# EAGLE design BpodMainBoard_r0_5 (EAGLE 6.3)
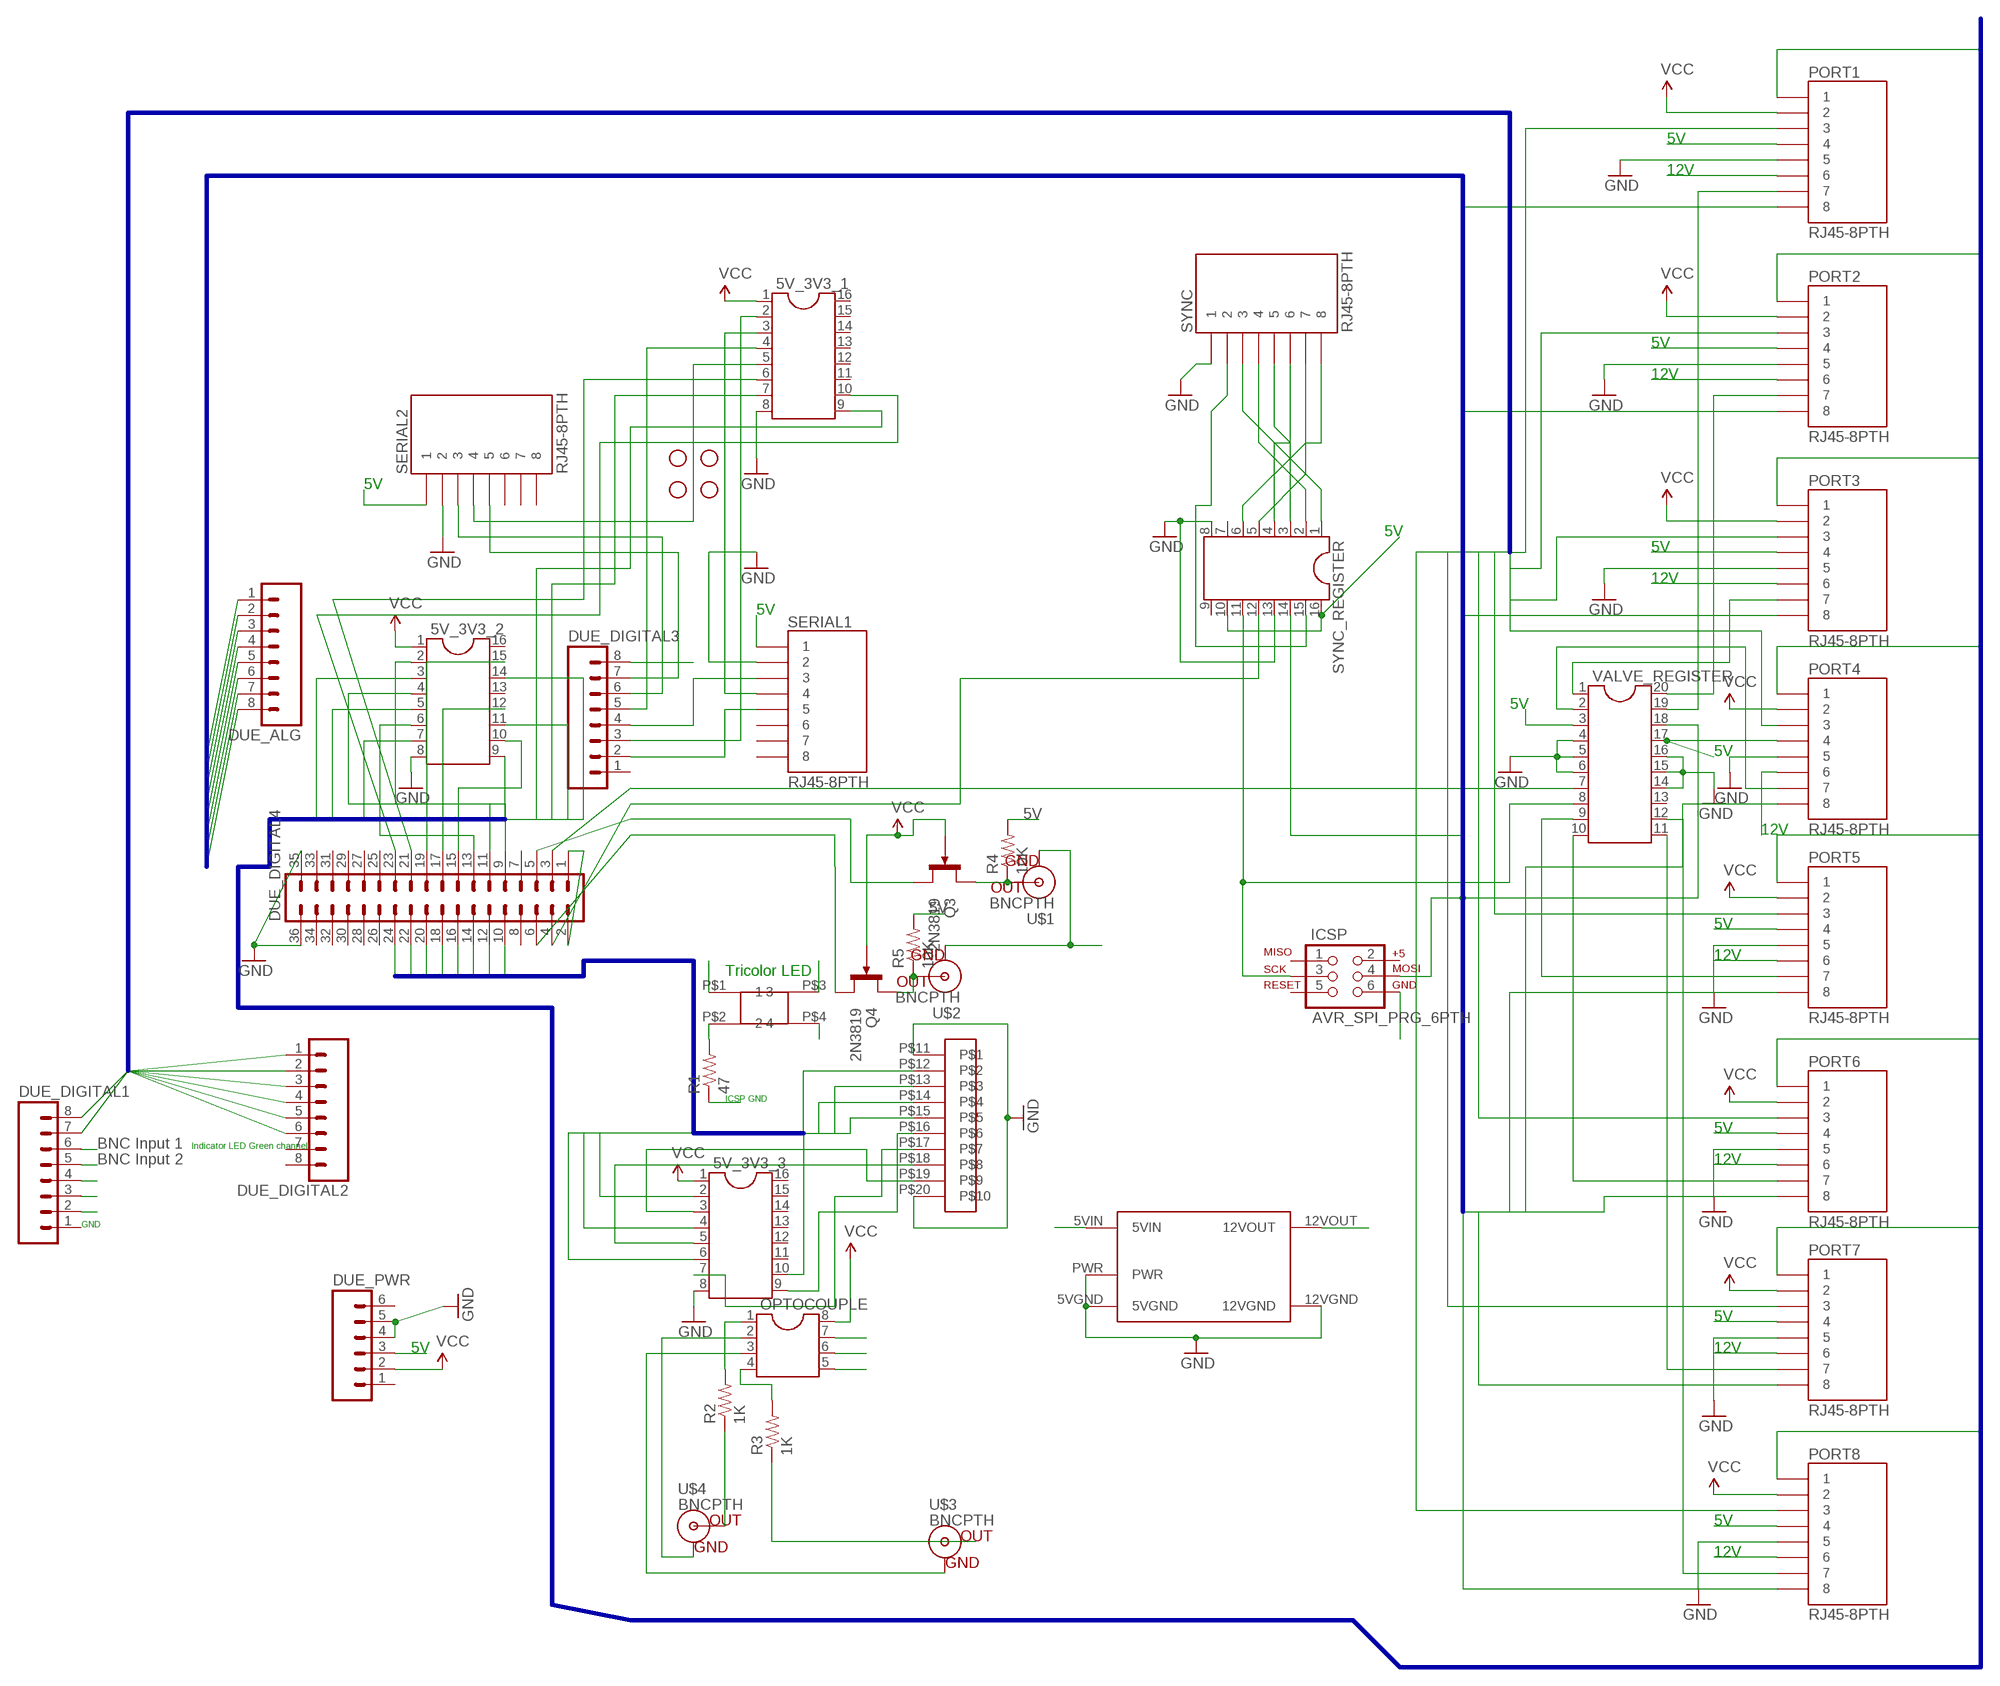
[diagram p0: schematic, sheet 1]

## Parts
5V_3V3_1  DIL16  [DIL16]
5V_3V3_2  DIL16  [DIL16]
5V_3V3_3  DIL16  [DIL16]
DUE_ALG  M081X08  [1X08]
DUE_DIGITAL1  M081X08  [1X08]
DUE_DIGITAL2  M081X08  [1X08]
DUE_DIGITAL3  M081X08  [1X08]
DUE_DIGITAL4  MA18-2  [MA18-2]
DUE_PWR  M06SIP  [1X06]
ICSP  AVR_SPI_PRG_6PTH  [2X3]
JP1  STAND-OFF  [STAND-OFF]
JP2  STAND-OFF  [STAND-OFF]
JP3  STAND-OFF  [STAND-OFF]
JP4  STAND-OFF  [STAND-OFF]
OPTOCOUPLE  DIL8  [DIL08]
PORT1  RJ45-8PTH  [RJ45-8]
PORT2  RJ45-8PTH  [RJ45-8]
PORT3  RJ45-8PTH  [RJ45-8]
PORT4  RJ45-8PTH  [RJ45-8]
PORT5  RJ45-8PTH  [RJ45-8]
PORT6  RJ45-8PTH  [RJ45-8]
PORT7  RJ45-8PTH  [RJ45-8]
PORT8  RJ45-8PTH  [RJ45-8]
Q3  2N3819  [TO92F]
Q4  2N3819  [TO92F]
R1  47  RESISTORAXIAL-0.3  [AXIAL-0.3]
R2  1K  RESISTORAXIAL-0.3  [AXIAL-0.3]
R3  1K  RESISTORAXIAL-0.3  [AXIAL-0.3]
R4  10K  RESISTORAXIAL-0.3  [AXIAL-0.3]
R5  10K  RESISTORAXIAL-0.3  [AXIAL-0.3]
SERIAL1  RJ45-8PTH  [RJ45-8]
SERIAL2  RJ45-8PTH  [RJ45-8]
SYNC  RJ45-8PTH  [RJ45-8]
SYNC_REGISTER  DIL16  [DIL16]
U$1  BNCPTH  [BNC]
U$2  BNCPTH  [BNC]
U$3  BNCPTH  [BNC]
U$4  BNCPTH  [BNC]
U$5  TDK_LAMBDA_5V_TO_12V  [TDK_LAMBDA_5V_12V]
U$6  10POS_SPRING_TERMINAL  [10POS_SCREW_TERMINAL]
U$8  SQUARE_TRICOLOR_LED  [SQUARE_TRICOLOR_LED]
VALVE_REGISTER  DIL20  [DIL20]

## Nets
5V: DUE_DIGITAL4.1 DUE_DIGITAL4.2 DUE_PWR.3 PORT1.4 PORT2.4 PORT3.4 PORT4.4 PORT5.4 PORT6.4 PORT7.4 PORT8.4 R4.P$2 R5.P$2 SERIAL1.1 SERIAL2.1 SYNC_REGISTER.10 SYNC_REGISTER.16 U$5.5VIN VALVE_REGISTER.3 VALVE_REGISTER.17
12V: PORT1.6 PORT2.6 PORT3.6 PORT4.6 PORT5.6 PORT6.6 PORT7.6 PORT8.6 U$5.12VOUT
ANALOG_BUS1: DUE_ALG.1 PORT1.8
ANALOG_BUS2: DUE_ALG.2 PORT2.8
ANALOG_BUS3: DUE_ALG.3 PORT3.8
ANALOG_BUS4: DUE_ALG.4 PORT4.8
ANALOG_BUS5: DUE_ALG.5 PORT5.8
ANALOG_BUS6: DUE_ALG.6 PORT6.8
ANALOG_BUS7: DUE_ALG.7 PORT7.8
ANALOG_BUS8: DUE_ALG.8 PORT8.8
BNCIN1: DUE_DIGITAL1.6 OPTOCOUPLE.7
BNCIN2: DUE_DIGITAL1.5 OPTOCOUPLE.6
DIGITAL_BUS1: 5V_3V3_2.3 PORT1.1
DIGITAL_BUS2: 5V_3V3_2.5 PORT2.1
DIGITAL_BUS3: 5V_3V3_2.7 PORT3.1
DIGITAL_BUS4: 5V_3V3_2.9 PORT4.1
DIGITAL_BUS5: 5V_3V3_2.11 PORT5.1
DIGITAL_BUS6: 5V_3V3_2.14 PORT6.1
DIGITAL_BUS7: 5V_3V3_1.7 PORT7.1
DIGITAL_BUS8: 5V_3V3_1.9 PORT8.1
DSUB_BUS1: 5V_3V3_3.2 DUE_DIGITAL4.10
DSUB_BUS2: 5V_3V3_3.4 DUE_DIGITAL4.12
DSUB_BUS3: 5V_3V3_3.6 DUE_DIGITAL4.14
DSUB_BUS4: 5V_3V3_3.10 DUE_DIGITAL4.16
DSUB_BUS5: DUE_DIGITAL4.18 U$6.P$15
DSUB_BUS6: DUE_DIGITAL4.20 U$6.P$14
DSUB_BUS7: DUE_DIGITAL4.22 U$6.P$13
DSUB_BUS8: DUE_DIGITAL4.24 U$6.P$12
GND: 5V_3V3_1.8 5V_3V3_2.8 5V_3V3_3.8 DUE_DIGITAL4.35 DUE_DIGITAL4.36 DUE_PWR.4 DUE_PWR.5 PORT1.5 PORT2.5 PORT3.5 PORT4.5 PORT5.5 PORT6.5 PORT7.5 PORT8.5 SERIAL1.2 SERIAL2.2 SYNC.1 SYNC_REGISTER.8 SYNC_REGISTER.13 U$5.5VGND U$5.12VGND U$5.PWR U$6.P$11 U$6.P$20 VALVE_REGISTER.4 VALVE_REGISTER.5 VALVE_REGISTER.6 VALVE_REGISTER.14 VALVE_REGISTER.15 VALVE_REGISTER.16
ICSP_GND: ICSP.6 R1.P$1
LED1: DUE_DIGITAL1.4 U$8.P$3
LED2: DUE_DIGITAL1.3 U$8.P$4
LED3: DUE_DIGITAL3.8 U$8.P$1
LED_BUS1: DUE_DIGITAL1.7 PORT1.3
LED_BUS2: DUE_DIGITAL1.8 PORT2.3
LED_BUS3: DUE_DIGITAL2.1 PORT3.3
LED_BUS4: DUE_DIGITAL2.2 PORT4.3
LED_BUS5: DUE_DIGITAL2.3 PORT5.3
LED_BUS6: DUE_DIGITAL2.4 PORT6.3
LED_BUS7: DUE_DIGITAL2.5 PORT7.3
LED_BUS8: DUE_DIGITAL2.6 PORT8.3
N$1: R2.P$1 U$4.S(OUT)
N$2: R3.P$1 U$3.S(OUT)
N$3: OPTOCOUPLE.1 R2.P$2
N$4: OPTOCOUPLE.4 R3.P$2
N$5: OPTOCOUPLE.2 U$4.GND
N$6: OPTOCOUPLE.3 U$3.GND
N$7: Q3.D R4.P$1 U$1.S(OUT)
N$8: Q4.D R5.P$1 U$2.S(OUT)
N$9: PORT1.7 VALVE_REGISTER.19
N$10: PORT2.7 VALVE_REGISTER.20
N$11: PORT3.7 VALVE_REGISTER.1
N$12: PORT4.7 VALVE_REGISTER.2
N$13: PORT5.7 VALVE_REGISTER.9
N$14: PORT6.7 VALVE_REGISTER.10
N$15: PORT7.7 VALVE_REGISTER.11
N$16: PORT8.7 VALVE_REGISTER.12
N$17: SYNC.2 SYNC_REGISTER.15
N$18: SYNC.3 SYNC_REGISTER.1
N$19: SYNC.4 SYNC_REGISTER.2
N$20: DUE_DIGITAL4.3 VALVE_REGISTER.7
N$21: SYNC.5 SYNC_REGISTER.3
N$22: SYNC.6 SYNC_REGISTER.4
N$23: SYNC.7 SYNC_REGISTER.5
N$24: SYNC.8 SYNC_REGISTER.6
N$25: R1.P$2 U$8.P$2
N$26: DUE_DIGITAL4.5 Q3.S
N$28: DUE_DIGITAL4.4 SYNC_REGISTER.12
N$29: DUE_DIGITAL4.6 Q4.S
N$32: 5V_3V3_1.3 SERIAL1.4
N$33: 5V_3V3_1.2 DUE_DIGITAL3.3
N$34: DUE_DIGITAL3.4 SERIAL1.3
N$35: 5V_3V3_1.5 SERIAL2.4
N$36: 5V_3V3_1.4 DUE_DIGITAL3.5
N$37: DUE_DIGITAL3.2 SERIAL1.5
N$39: 5V_3V3_1.6 DUE_DIGITAL4.21
N$40: DUE_DIGITAL3.6 SERIAL2.3
N$41: 5V_3V3_1.10 DUE_DIGITAL4.23
N$42: DUE_DIGITAL3.7 SERIAL2.5
N$43: 5V_3V3_2.2 DUE_DIGITAL4.9
N$44: 5V_3V3_2.4 DUE_DIGITAL4.11
N$45: 5V_3V3_2.6 DUE_DIGITAL4.13
N$46: 5V_3V3_2.10 DUE_DIGITAL4.15
N$47: 5V_3V3_2.12 DUE_DIGITAL4.17
N$48: 5V_3V3_2.15 DUE_DIGITAL4.19
N$49: 5V_3V3_3.3 U$6.P$19
N$50: 5V_3V3_3.5 U$6.P$18
N$51: 5V_3V3_3.7 U$6.P$17
N$52: 5V_3V3_3.9 U$6.P$16
SPI_CLK: ICSP.3 SYNC_REGISTER.11 VALVE_REGISTER.8
SPI_DATA: ICSP.4 SYNC_REGISTER.14 VALVE_REGISTER.18
UPPER_GND: DUE_DIGITAL1.2 OPTOCOUPLE.5 U$1.GND U$2.GND
VCC: 5V_3V3_1.1 5V_3V3_2.1 5V_3V3_3.1 DUE_PWR.2 OPTOCOUPLE.8 PORT1.2 PORT2.2 PORT3.2 PORT4.2 PORT5.2 PORT6.2 PORT7.2 PORT8.2 Q3.G Q4.G
Unconnected: 5V_3V3_1.11 5V_3V3_1.12 5V_3V3_1.13 5V_3V3_1.14 5V_3V3_1.15 5V_3V3_1.16 5V_3V3_2.13 5V_3V3_2.16 5V_3V3_3.11 5V_3V3_3.12 5V_3V3_3.13 5V_3V3_3.14 5V_3V3_3.15 5V_3V3_3.16 DUE_DIGITAL1.1 DUE_DIGITAL2.7 DUE_DIGITAL2.8 DUE_DIGITAL3.1 DUE_DIGITAL4.7 DUE_DIGITAL4.8 DUE_DIGITAL4.25 DUE_DIGITAL4.26 DUE_DIGITAL4.27 DUE_DIGITAL4.28 DUE_DIGITAL4.29 DUE_DIGITAL4.30 DUE_DIGITAL4.31 DUE_DIGITAL4.32 DUE_DIGITAL4.33 DUE_DIGITAL4.34 DUE_PWR.1 DUE_PWR.6 ICSP.1 ICSP.2 ICSP.5 SERIAL1.6 SERIAL1.7 SERIAL1.8 SERIAL2.6 SERIAL2.7 SERIAL2.8 SYNC_REGISTER.7 SYNC_REGISTER.9 VALVE_REGISTER.13

## Buses
LED_BUS[1..8]
DSUB_BUS[1..8]
ANALOG_BUS[1..8]
DIGITAL_BUS[1..8]

## Notes on the sheet
- 5V
- 12V
- 5V
- 12V
- 5V
- 5V
- 5V
- 12V
- 5V
- 5V
- 5V
- 5V
- 12V
- 5V
- 5V
- 12V
- Tricolor LED
- ICSP GND
- 5V
- BNC Input 1 | Indicator LED Green channel
- BNC Input 2 | 12V
- GND
- 5V
- 5V | 12V
- 5V
- 12V

## Library data of the parts
5V_3V3_1-5V_3V3_3 SYNC_REGISTER = ic-package:DIL16: Dual In Line / Socket
DUE_ALG DUE_DIGITAL1-DUE_DIGITAL3 = SparkFun:M08: Header 8 Standard 8-pin 0.1" header. Use with straight break away headers (SKU : PRT-00116), right angle break away headers (PRT-00553), swiss pins (PRT-00743), machine pins (PRT-00117), and female headers (PRT-00115).
DUE_DIGITAL4 = con-lstb:MA18-2: PIN HEADER
DUE_PWR = SparkFun:M06: Header 6 Standard 6-pin 0.1" header. Use with straight break away headers (SKU : PRT-00116), right angle break away headers (PRT-00553), swiss pins (PRT-00743), machine pins (PRT-00117), and female headers (PRT-00115). Molex polarized connector foot print use with SKU : PRT-08094 with associated crimp pins and housings. NOTES ON THE VARIANTS LOCK and LOCK_LONGPADS... This footprint was designed to help hold the alignment of a through-hole component (i.e. 6-pin header) while soldering it into place. You may notice that each hole has been shifted either up or down by 0.005 of an inch from it's more standard position (which is a perfectly straight line). This slight alteration caused the pins (the squares in the middle) to touch the edges of the holes. Because they are alternating, it causes a "brace" to hold the component in place. 0.005 has proven to be the perfect amount of "off-center" position when using our standard breakaway headers. Although looks a little odd when you look at the bare footprint, once you have a header in there, the alteration is very hard to notice. Also, if you push a header all the way into place, it is covered up entirely on the bottom side. This idea of altering the position of holes to aid alignment will be further integrated into the Sparkfun Library for other footprints. It can help hold any component with 3 or more connection pins.
ICSP = SparkFun:AVR_SPI_PRG_6: AVR ISP 6 Pin This is the reduced ISP connector for AVR programming. Common on Arduino. This footprint will take up less PCB space and can be used with a 10-pin to 6-pin adapter such as SKU: BOB-08508
JP1-JP4 = SparkFun:STAND-OFF: Stand Off This is the mechanical footprint for a #4 phillips button head screw. Use the keepout ring to avoid running the screw head into surrounding components. SKU : PRT-00447
OPTOCOUPLE = ic-package:DIL8: Dual In Line / Socket
PORT1-PORT8 SERIAL1 SERIAL2 SYNC = SparkFun:RJ45-8: RJ45 Jack Simple RJ45, 8-pin connection - connector for common Cat5, Cat5e, and Cat6 Ethernet cables. Footprint not yet proven in production. Connector sku is PRT-00643; Breakout PCB sku is BOB-00716.
Q3 Q4 = transistor-small-signal:2N3819: N-CHANNEL FET
R1 = SparkFun-Passives:RESISTOR: Resistor Basic schematic elements and footprints for 0603, 1206, and PTH resistors.
R2-R5 = SparkFun:RESISTOR: Resistor Basic schematic elements and footprints for 0603, 1206, and PTH resistors.
U$1-U$4 = SparkFun:BNC: BNC Connector, Mouser Part# 5227161
U$5 = JoshParts:TDK_LAMBDA_5V_TO_12V
U$6 = JoshParts:10POS_SPRING_TERMINAL
U$8 = JoshParts:SQUARE_TRICOLOR_LED
VALVE_REGISTER = ic-package:DIL20: Dual In Line / Socket

## Net classes
0 default: width 0.254 mm, clearance 0.254 mm

## Board
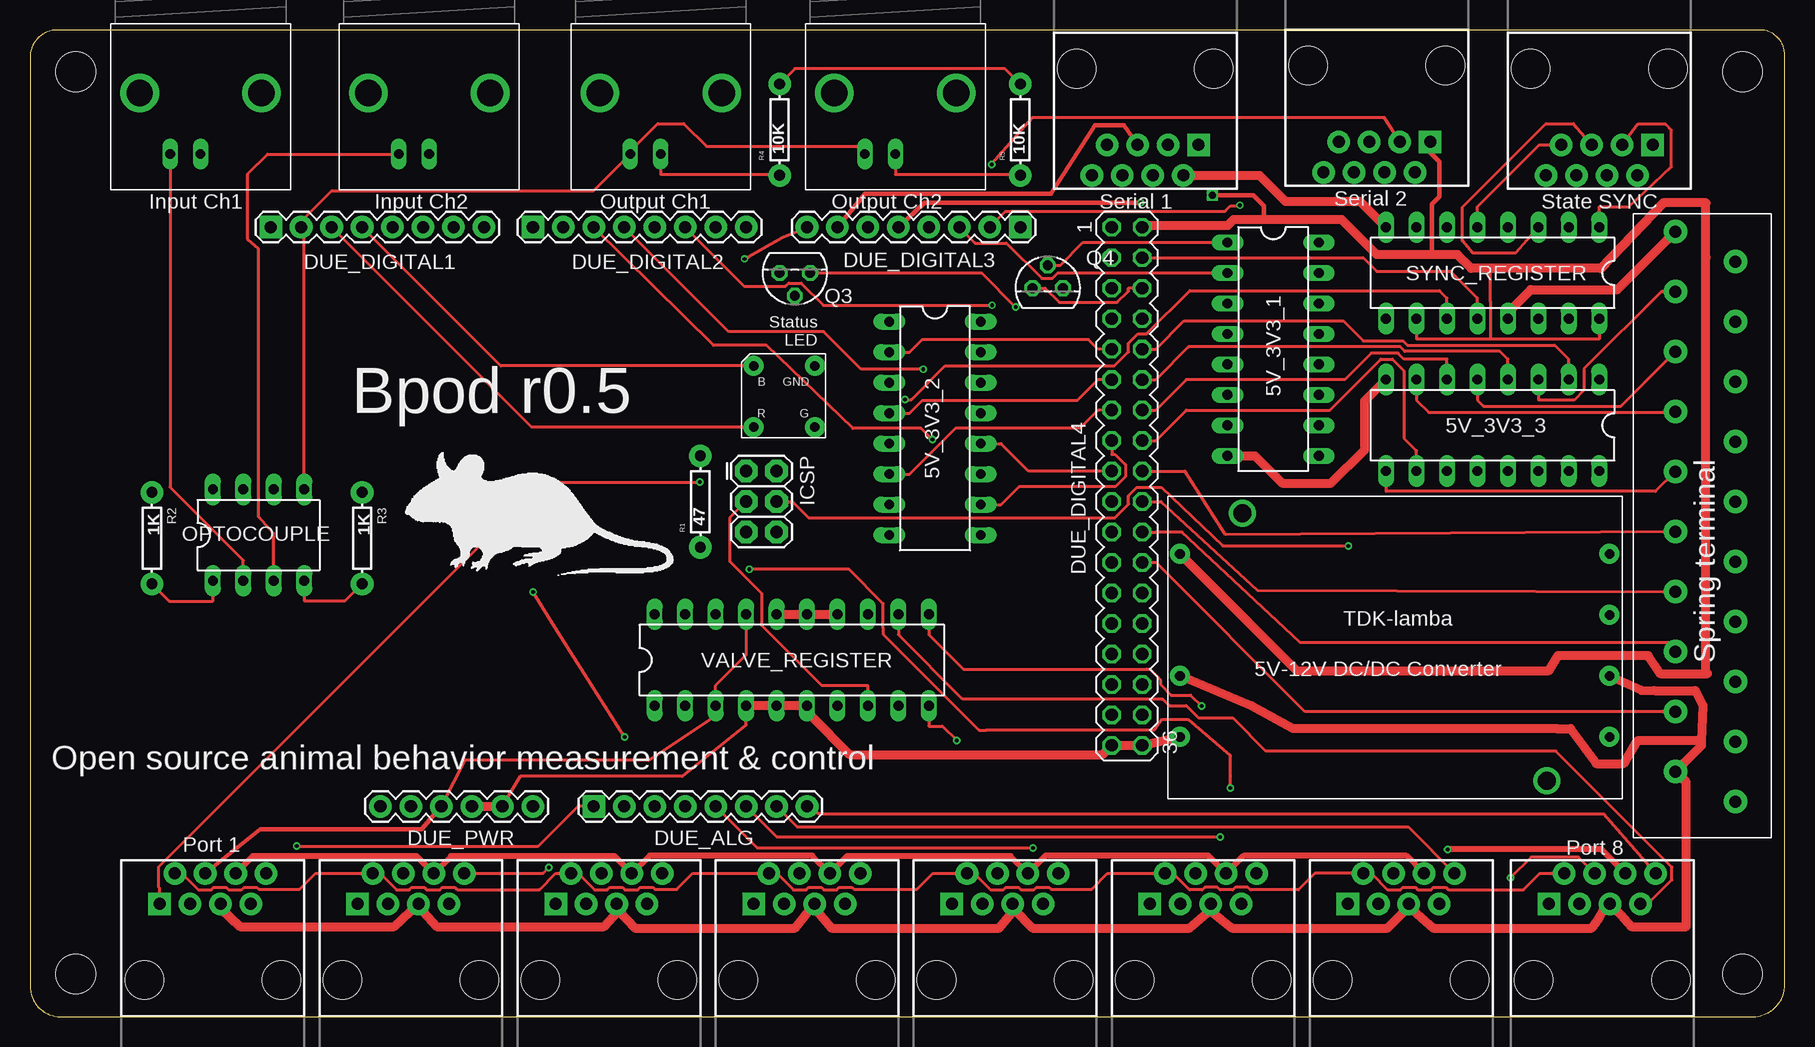
[diagram p1: board, top side]
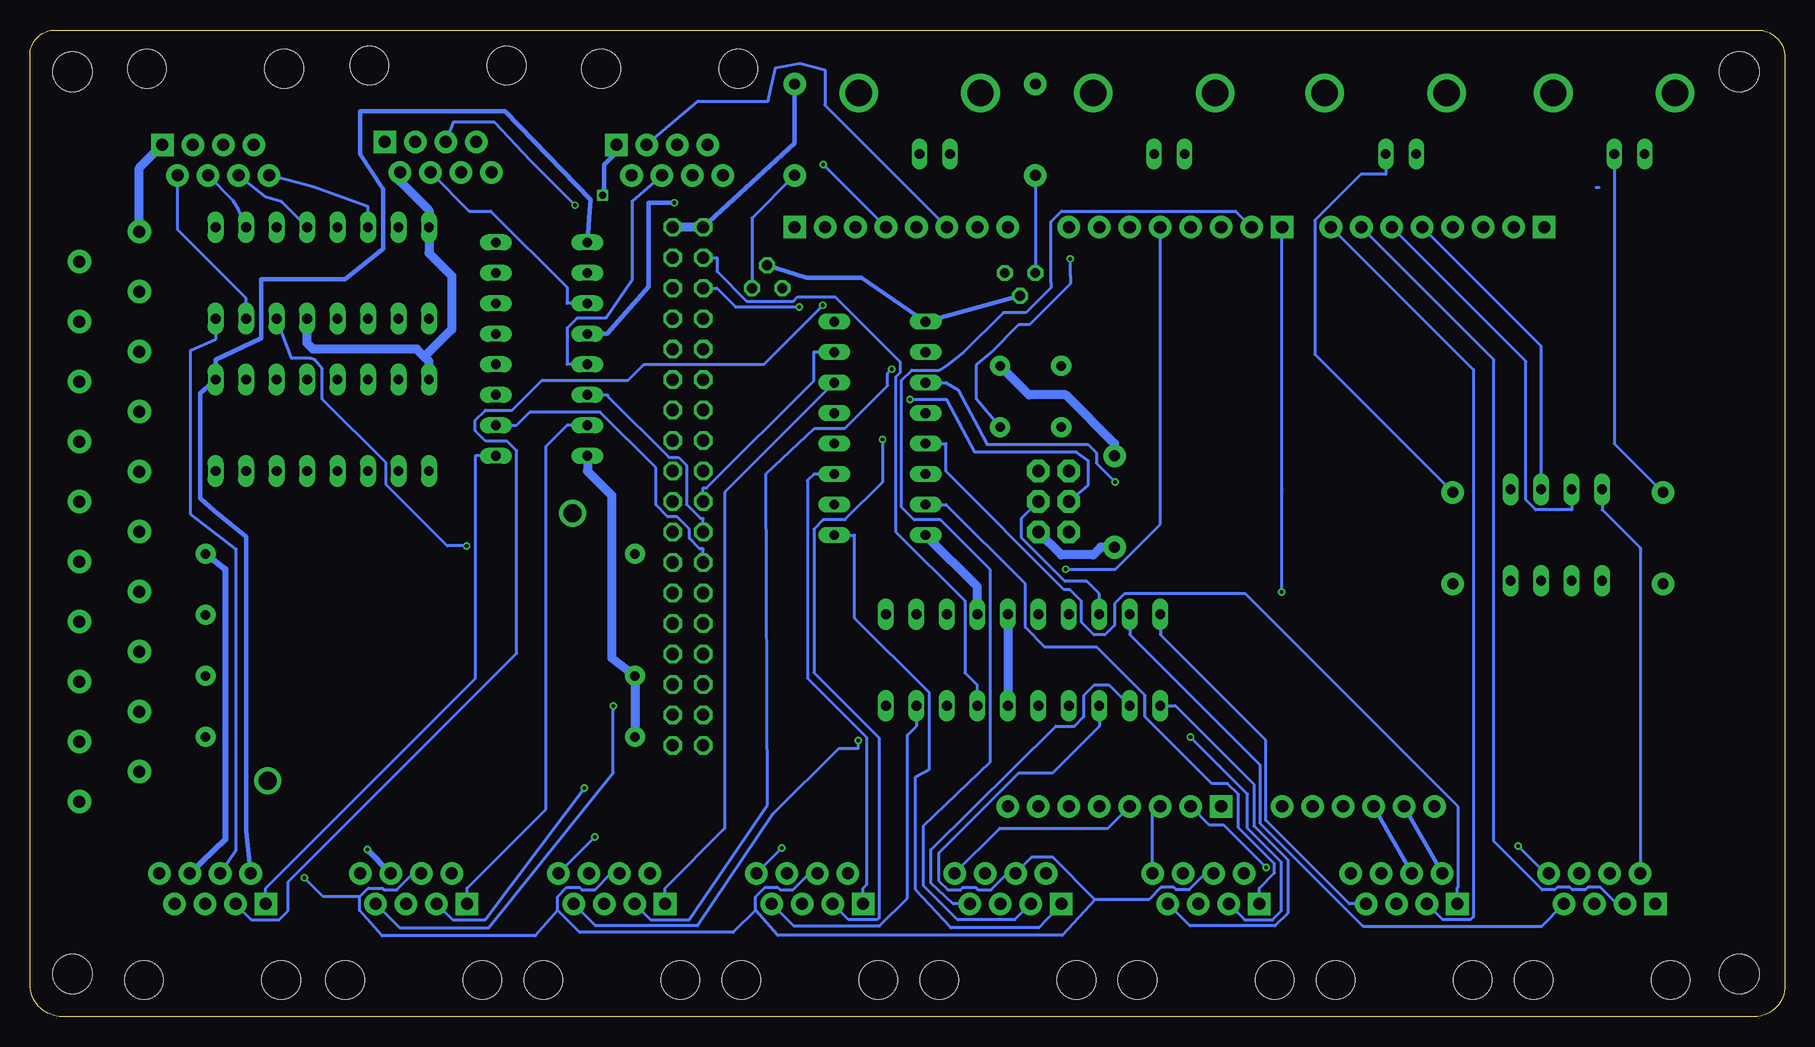
[diagram p2: board, bottom side, seen from below]

Size 146.28 x 82.22 mm. Coordinates in mm from the lower left corner, seen from the top.
Outline: 143.6,0 arc90 146.28,2.69 146.28,80.13 arc90 144.2,82.22 2.28,82.22 arc90 0,79.94 0,2.54 arc90 2.54,0 143.6,0
Copper layers (1*16): Top 0.035mm / dielectric 1.5mm / Bottom 0.035mm
Design rules "SeeedStudio_2layer_DRU_no_angle_20140221": minimum track width 6mil, minimum drill 12mil, track to track 6mil, track to pad 6mil, pad to pad 6mil, via to via 6mil, smd to smd 0mil, copper to edge 10mil, drill to drill 10mil, minimum pad ring 10mil, minimum via ring 6mil, stop-mask expansion 2mil, vias tented up to drill 100mil, thermal gap 10mil

### Footprints (pad centres in the part's own frame; a part is rotated, then mirrored left to right if it is on the bottom)
DIL16 = drill 0.813 long: 1 -8.89,-3.81; 2 -6.35,-3.81; 3 -3.81,-3.81; 4 -1.27,-3.81; 5 1.27,-3.81; 6 3.81,-3.81; 7 6.35,-3.81; 8 8.89,-3.81; 9 8.89,3.81; 10 6.35,3.81; 11 3.81,3.81; 12 1.27,3.81; 13 -1.27,3.81; 14 -3.81,3.81; 15 -6.35,3.81; 16 -8.89,3.81
1X08 = drill 1.016 pad 1.88 square: 1 0,0 | drill 1.016 pad 1.88: 2 2.54,0; 3 5.08,0; 4 7.62,0; 5 10.16,0; 6 12.7,0; 7 15.24,0; 8 17.78,0
MA18-2 = drill 1.016 octagon: 1 -21.59,-1.27; 2 -21.59,1.27; 3 -19.05,-1.27; 4 -19.05,1.27; 5 -16.51,-1.27; 6 -16.51,1.27; 7 -13.97,-1.27; 8 -13.97,1.27; 9 -11.43,-1.27; 10 -11.43,1.27; 11 -8.89,-1.27; 12 -8.89,1.27; 13 -6.35,-1.27; 14 -6.35,1.27; 15 -3.81,-1.27; 16 -3.81,1.27; 17 -1.27,-1.27; 18 -1.27,1.27; 19 1.27,-1.27; 20 1.27,1.27; 21 3.81,-1.27; 22 3.81,1.27; 23 6.35,-1.27; 24 6.35,1.27; 25 8.89,-1.27; 26 8.89,1.27; 27 11.43,-1.27; 28 11.43,1.27; 29 13.97,-1.27; 30 13.97,1.27; 31 16.51,-1.27; 32 16.51,1.27; 33 19.05,-1.27; 34 19.05,1.27; 35 21.59,-1.27; 36 21.59,1.27
1X06 = drill 1.016 pad 1.88: 1 0,0; 2 2.54,0; 3 5.08,0; 4 7.62,0; 5 10.16,0; 6 12.7,0
2X3 = drill 1.016 pad 1.88 octagon: 1 0,0; 2 0,2.54; 3 2.54,0; 4 2.54,2.54; 5 5.08,0; 6 5.08,2.54
STAND-OFF = hole 3.302: 0,0
DIL08 = drill 0.813 long: 1 -3.81,-3.81; 2 -1.27,-3.81; 3 1.27,-3.81; 4 3.81,-3.81; 5 3.81,3.81; 6 1.27,3.81; 7 -1.27,3.81; 8 -3.81,3.81
RJ45-8 = drill 1 pad 1.88 square: 1 -4.445,6.35 | drill 1 pad 1.88: 2 -3.175,8.89; 3 -1.905,6.35; 4 -0.635,8.89; 5 0.635,6.35; 6 1.905,8.89; 7 3.175,6.35; 8 4.445,8.89 | hole 3.2: -5.715,0; 5.715,0
TO92F = drill 0.813 octagon: D 1.27,0; G 0,1.905; S -1.27,0
AXIAL-0.3 = drill 0.9 pad 1.88: P$1 -3.81,0; P$2 3.81,0
BNC = drill 2.2: 3 -5.08,5.08; 4 5.08,5.08 | drill 0.8 long: GND -2.54,0; S 0,0
TDK_LAMBDA_5V_12V = drill 0.8 pad 1.676: 5VGND -6,-12.24; 5VIN -6,3; 12VGND 29.8,-7.16; 12VOUT 29.8,3; P$4 29.8,-12.24; P$6 29.8,-2.08; PWR -6,-7.16 | drill 1.5: P$8 -0.8,6.4; P$9 24.6,-15.92
10POS_SCREW_TERMINAL = drill 1 pad 1.93: P$1 -10,-5; P$2 -5,-5; P$3 0,-5; P$4 5,-5; P$5 10,-5; P$6 -15,-5; P$7 15,-5; P$8 -20,-5; P$9 20,-5; P$10 -25,-5; P$11 -22.5,0; P$12 -17.5,0; P$13 -12.5,0; P$14 -7.5,0; P$15 -2.5,0; P$16 2.5,0; P$17 7.5,0; P$18 12.5,0; P$19 17.5,0; P$20 22.5,0
SQUARE_TRICOLOR_LED = drill 0.8 pad 1.676: P$1 -5.1,5.1; P$2 -5.1,0; P$3 0,0; P$4 0,5.1
DIL20 = drill 0.813 long: 1 -11.43,-3.81; 2 -8.89,-3.81; 3 -6.35,-3.81; 4 -3.81,-3.81; 5 -1.27,-3.81; 6 1.27,-3.81; 7 3.81,-3.81; 8 6.35,-3.81; 9 8.89,-3.81; 10 11.43,-3.81; 11 11.43,3.81; 12 8.89,3.81; 13 6.35,3.81; 14 3.81,3.81; 15 1.27,3.81; 16 -1.27,3.81; 17 -3.81,3.81; 18 -6.35,3.81; 19 -8.89,3.81; 20 -11.43,3.81

### Placement (x,y rotation side)
5V_3V3_1  103.63,55.63 270 top
5V_3V3_2  75.44,49.02 270 top
5V_3V3_3  121.92,49.28 180 top
DUE_ALG  46.99,17.53 0 top
DUE_DIGITAL1  20.07,65.79 0 top
DUE_DIGITAL2  41.91,65.79 0 top
DUE_DIGITAL3  82.55,65.79 180 top
DUE_DIGITAL4  91.44,44.2 270 top
DUE_PWR  29.21,17.53 0 top
ICSP  59.69,45.47 270 top
JP1  3.81,78.74 0 top
JP2  3.81,3.56 0 top
JP3  142.75,3.56 0 top
JP4  142.75,78.74 0 top
OPTOCOUPLE  19.05,40.13 0 top
PORT1  15.24,3.05 0 top
PORT2  31.75,3.05 0 top
PORT3  48.26,3.05 0 top
PORT4  64.77,3.05 0 top
PORT5  81.28,3.05 0 top
PORT6  97.79,3.05 0 top
PORT7  114.3,3.05 0 top
PORT8  131.06,3.05 0 top
Q3  63.75,61.98 180 top
Q4  84.84,60.71 0 top
R1  55.88,42.93 90 top
R2  10.16,39.88 270 top
R3  27.69,39.88 270 top
R4  62.48,73.91 90 top
R5  82.55,73.91 90 top
SERIAL1  112.27,79.25 180 top
SERIAL2  92.96,78.99 180 top
SYNC  130.81,78.99 180 top
SYNC_REGISTER  121.92,61.98 180 top
U$1  52.58,71.88 0 top
U$2  72.14,71.88 0 top
U$3  33.27,71.88 0 top
U$4  14.22,71.88 0 top
U$5  101.85,35.56 0 top
U$6  137.16,42.93 90 top
U$7  [MOUSELOGO]  29.34,48.9 270 top
U$8  60.33,54.23 180 top
VALVE_REGISTER  63.5,29.72 0 top

### Tracks (layer width: path | path; a pad name or v marks a point on that pad's centre or on a via)
5V  (via drill 0.3 pad 0.61, 0.6)
  Top 0.254: DUE_PWR.3 35.33,19.58 36.22,21.36 51.55,21.36 57.15,25.06 VALVE_REGISTER.3 57.15,27.61 59.69,30.15 VALVE_REGISTER.17 | PORT8.4 129.07,13.3 125.14,13.3 v123.41,11.57 | 121.72,56.46 115.57,56.46 SYNC_REGISTER.10 | 121.72,56.46 121.72,59.6 121.72,62.31 121.67,62.36 | 121.72,56.46 130.81,56.46 SYNC_REGISTER.16 | R5.P$2 81.27,79 63.77,79 R4.P$2
  Top 0.381: PORT1.4 19.18,15.62 32.64,15.62 DUE_PWR.3 | SERIAL1.1 116.71,72.01 117.47,71.25 117.47,68.33 116.84,67.69 116.84,63.5 | v98.55,68.45 101.98,68.45 102.87,67.56 102.87,66.42
  Top 0.762: U$5.5VIN 105.58,28.83 126.62,28.83 127.38,30.1 134.87,30.1 135.89,28.57 139.83,28.57 139.7,28.7 139.7,63.25 139.7,67.82 136.14,67.82 130.94,62.36 121.92,62.36 121.67,62.36 120.14,62.36 119,63.5 116.84,63.5 112.27,63.5 109.35,66.42 102.87,66.42 100.33,66.42 99.82,65.91 92.84,65.91 DUE_DIGITAL4.2
  Bottom 0.254: VALVE_REGISTER.3 57.15,24.21 61.06,20.3 63.87,20.3 70.55,13.63 70.55,11.34 69.78,10.57 68.72,10.57 68.52,10.77 67.45,10.77 67.25,10.57 66.18,10.57 64.81,11.94 PORT4.4 62.8,13.27 61.03,13.27 57.5,9.74 | SYNC_REGISTER.16 130.81,56.46 132.87,55.55 132.87,41.85 129.08,38.95 129.08,13.92 PORT8.4 | 102.3,8.86 102.3,10.01 101.54,10.77 100.47,10.77 100.27,10.57 99.2,10.57 97.83,11.94 PORT6.4 96.96,12.13 | 85.82,8.88 87.67,7.03 100.47,7.03 102.3,8.86 | 102.3,8.86 104.16,6.74 116.95,6.74 118.81,8.85 118.81,10.01 | 118.81,10.01 118.1,10.72 116.93,10.72 116.78,10.57 115.71,10.57 114.34,11.94 PORT7.4 | 118.81,10.01 121.85,10.01 v123.41,11.57 | 85.82,8.88 85.82,9.97 85.03,10.77 83.96,10.77 83.76,10.57 82.69,10.57 81.32,11.94 PORT5.4 | 57.5,9.74 60.23,6.76 83.96,6.76 85.82,8.88 | PORT3.4 48.3,11.94 49.67,10.57 50.74,10.57 50.94,10.77 52.01,10.77 53.03,9.74 57.5,9.74
  Bottom 0.381: R5.P$2 82.55,72.77 DUE_DIGITAL4.1 | PORT2.4 DUE_PWR.3 | SERIAL2.1 97.41,72.01 98.42,70.99 98.42,68.58 v98.55,68.45
  Bottom 0.762: DUE_DIGITAL4.1 DUE_DIGITAL4.2
12V  (via drill 0.3 pad 0.61)
  Top 0.508: PORT1.6 18.6,13.39 32.2,13.39 PORT2.6 35.1,13.39 48.72,13.39 PORT3.6 51.65,13.42 65.19,13.42 PORT4.6 68.12,13.39 81.74,13.39 PORT5.6 84.66,13.41 98.22,13.41 PORT6.6 101.15,13.39 114.75,13.39 PORT7.6 | PORT8.6 130.97,13.94 v118.17,13.94
  Bottom 0.508: U$5.12VOUT 130,37.29 130,14.78 PORT8.6 | v118.17,13.94 116.2,11.97 PORT7.6
ANALOG_BUS1  (via drill 0.3 pad 0.61)
  Top 0.254: DUE_ALG.1 45.67,17.53 42.36,14.22 v22.23,14.22
  Bottom 0.254: PORT1.8 19.95,11.94 v22.23,14.22
ANALOG_BUS2  (via drill 0.3 pad 0.61)
  Top 0.254: PORT2.8 42.76,11.94 v43.25,12.43
  Bottom 0.254: v43.25,12.43 46.77,15.95 47.95,15.95 DUE_ALG.2
ANALOG_BUS3
  Bottom 0.254: PORT3.8 52.7,16.89 DUE_ALG.3
ANALOG_BUS4
  Bottom 0.254: PORT4.8 65.44,15.71 56.42,15.71 DUE_ALG.4
ANALOG_BUS5  (via drill 0.3 pad 0.61)
  Top 0.254: DUE_ALG.5 60.62,14.05 v83.61,14.05
  Bottom 0.254: PORT5.8 v83.61,14.05
ANALOG_BUS6  (via drill 0.3 pad 0.61)
  Top 0.254: DUE_ALG.6 62.24,14.97 v99.2,14.97
  Bottom 0.254: PORT6.8 v99.2,14.97
ANALOG_BUS7
  Top 0.254: DUE_ALG.7 63.95,15.81 114.88,15.81 PORT7.8
ANALOG_BUS8
  Top 0.254: DUE_ALG.8 65.78,16.89 131.19,16.89 PORT8.8
BNCIN1
  Bottom 0.254: OPTOCOUPLE.7 17.78,42.24 20.77,42.24 21.59,43.06 21.59,54.61 DUE_DIGITAL1.6
BNCIN2
  Bottom 0.254: OPTOCOUPLE.6 20.32,55.88 DUE_DIGITAL1.5
DIGITAL_BUS1  (via drill 0.3 pad 0.61)
  Top 0.254: v55.82,44.54 42.79,44.54 10.74,12.5 10.74,10.77 10.79,10.72 PORT1.1
  Bottom 0.254: 5V_3V3_2.3 69.93,52.83 68.91,52.22 66.53,47.68 58.96,47.68 58.09,47.68 57.4,46.99 57.4,46.12 v55.82,44.54
DIGITAL_BUS2
  Bottom 0.254: 5V_3V3_2.5 69.93,47.75 69.93,45.43 60.08,35.59 59.62,35.59 58.65,34.62 58.65,32.87 57.58,31.81 56.68,31.81 55.88,32.61 55.88,34.4 55.05,35.24 44.98,35.24 27.23,17.48 27.23,10.79 27.3,10.72 PORT2.1
DIGITAL_BUS3
  Bottom 0.254: 5V_3V3_2.7 69.93,42.67 63.32,36.07 63.32,32.44 61.68,30.8 57.36,30.8 53.34,26.78 53.34,24.99 47.77,19.43 46.46,19.43 45.55,18.51 45.55,15.74 42.55,12.73 42.55,11.99 43.81,10.72 PORT3.1
DIGITAL_BUS4
  Bottom 0.254: PORT4.1 62.2,7.4 69.53,7.4 72.45,10.58 72.45,19.97 71.31,20.61 71.31,26.97 77.55,33.21 77.55,40.13 5V_3V3_2.9
DIGITAL_BUS5
  Bottom 0.254: 5V_3V3_2.11 80.95,45.21 81.48,44.69 81.48,28.21 76.57,23.3 76.57,10.99 76.83,10.72 PORT5.1
DIGITAL_BUS6
  Bottom 0.254: 5V_3V3_2.14 88.39,43.7 88.39,15.68 93.34,10.72 PORT6.1
DIGITAL_BUS7
  Bottom 0.254: 5V_3V3_1.7 101.52,49.28 103.27,47.53 103.27,17.3 109.86,10.72 PORT7.1
DIGITAL_BUS8
  Bottom 0.254: 5V_3V3_1.9 109.14,46.74 109.14,28.19 126.62,10.72 PORT8.1
DSUB_BUS1
  Top 0.254: 5V_3V3_3.2 128.27,54.79 127.1,55.96 114.81,55.96 114.45,56.31 111.13,56.31 109.47,57.98 96.2,57.98 93.85,55.63 DUE_DIGITAL4.10
DSUB_BUS2
  Top 0.254: 5V_3V3_3.4 123.19,54.79 122.53,55.45 114.59,55.45 114.24,55.8 96.57,55.8 93.85,53.09 DUE_DIGITAL4.12
DSUB_BUS3
  Top 0.254: 5V_3V3_3.6 118.11,54.79 114.54,54.79 114.03,55.3 111.8,55.3 109.59,53.09 96.39,53.09 93.85,50.55 DUE_DIGITAL4.14
DSUB_BUS4
  Top 0.254: 5V_3V3_3.10 115.57,47.17 114.53,48.21 114.53,53.82 113.56,54.79 112.6,54.79 108.36,50.55 96.39,50.55 93.85,48.01 DUE_DIGITAL4.16
DSUB_BUS5
  Top 0.254: DUE_DIGITAL4.18 96.27,45.47 99.66,40.17 U$6.P$15
DSUB_BUS6
  Top 0.254: DUE_DIGITAL4.20 94.29,42.93 102.3,35.55 U$6.P$14
DSUB_BUS7
  Top 0.254: DUE_DIGITAL4.22 93.85,40.39 96.03,40.39 105.86,31.19 136.53,31.19 U$6.P$13
DSUB_BUS8
  Top 0.254: U$6.P$12 106.27,25.43 93.85,37.85 DUE_DIGITAL4.24
GND
  Top 0.254: DUE_PWR.5 40.86,20.03 54.37,20.03 59.69,24.33 VALVE_REGISTER.4 | VALVE_REGISTER.6 64.77,25.06
  Top 0.762: U$5.5VGND DUE_DIGITAL4.36 DUE_DIGITAL4.35 89.41,21.84 68.33,21.84 65.11,25.06 64.77,25.06 | VALVE_REGISTER.6 VALVE_REGISTER.5 VALVE_REGISTER.4 | VALVE_REGISTER.16 VALVE_REGISTER.15 VALVE_REGISTER.14 | U$5.12VGND 134.35,27.2 135.38,27.18 138.81,27.18 139.45,25.91 139.32,22.99 | 139.32,22.99 133.99,22.99 132.84,21.08 130.56,21.08 128.4,24 127.25,24 105.28,24 101.78,25.91 U$5.PWR 95.96,28.07 | 139.32,22.99 139.32,22.59 U$6.P$11 137.18,20.43 138.05,19.56 138.05,7.49 133.48,7.49 132.59,8.51 PORT8.5 131.19,8.89 130.81,8.26 130.18,7.37 116.97,7.37 114.94,9.14 | 114.94,9.14 PORT7.5 114.68,9.14 114.94,9.14 | PORT6.5 98.42,8.89 | 98.42,8.89 98.42,8.76 100.2,7.37 113.16,7.37 113.54,7.75 114.94,9.14 | PORT5.5 81.92,9.02 82.04,8.89 | 82.04,8.89 83.57,7.37 96.65,7.37 98.42,8.89 | 82.04,8.89 80.77,7.37 66.8,7.37 65.41,9.02 PORT4.5 63.75,7.37 50.42,7.37 49.05,8.83 | PORT3.5 48.9,9.02 49.05,8.83 | 49.05,8.83 47.84,7.49 33.91,7.49 32.38,9.14 PORT2.5 30.35,7.49 17.53,7.49 15.88,9.02 PORT1.5 | DUE_PWR.4 DUE_PWR.5 | 5V_3V3_1.8 102.11,46.74 104.39,44.45 108.46,44.45 111.25,47.24 111.25,51.31 5V_3V3_3.8 | SYNC_REGISTER.13 123.19,58.67 125.09,60.58 132.31,60.58 U$6.P$20 | SERIAL2.2 102.49,70.1 104.65,67.94 110.87,67.94 SYNC_REGISTER.8
  Bottom 0.254: 33.06,9.4 PORT2.5
  Bottom 0.762: U$5.5VGND U$5.PWR 97.79,29.9 97.79,43.43 99.82,45.47 5V_3V3_1.8 | VALVE_REGISTER.15 VALVE_REGISTER.6 | VALVE_REGISTER.14 67.31,35.81 5V_3V3_2.8 | 5V_3V3_3.8 113.03,54.61 113.41,54.99 | 113.41,54.99 114.05,55.63 122.68,55.63 123.19,56.13 SYNC_REGISTER.13 | 113.41,54.99 111.12,57.28 111.12,61.72 113.03,63.63 SYNC_REGISTER.8 113.03,67.18 115.44,69.6 SERIAL1.2 | U$6.P$20 137.16,70.74 SYNC.1
ICSP_GND
  Bottom 0.762: R1.P$1 57.02,39.12 57.66,38.48 60.33,38.48 ICSP.6
LED1
  Top 0.254: U$8.P$3 39.24,54.23 DUE_DIGITAL1.4
LED2
  Top 0.254: U$8.P$4 41.8,49.13 DUE_DIGITAL1.3
LED3  (via drill 0.3)
  Top 0.254: v59.56,63.15 62.74,64.93 DUE_DIGITAL3.8
  Bottom 0.254: U$8.P$1 67.37,51.46 67.37,54.32 66.2,55.34 63.88,57.66 62.99,57.66 59.56,61.09 59.56,61.72 v59.56,63.15
LED_BUS1
  Bottom 0.254: PORT1.3 14.01,9.4 15.38,10.77 16.45,10.77 16.65,10.57 17.72,10.57 17.92,10.77 18.99,10.77 19.19,10.57 20.23,10.57 24.26,14.6 24.26,54.74 DUE_DIGITAL1.7
LED_BUS2
  Bottom 0.254: DUE_DIGITAL1.8 25.97,53.91 25.97,8.32 26.21,8.08 28.52,8.08 PORT2.3
LED_BUS3  (via drill 0.3 pad 0.61)
  Top 0.254: v49.56,23.29 43.97,32.08 v41.94,35.38
  Bottom 0.254: PORT3.3 45.02,8.06 42.72,8.06 41.95,8.83 41.95,12.86 44.79,15.7 44.79,18.54 47.13,20.88 v49.56,23.29 | v41.94,35.38 41.91,43.92 DUE_DIGITAL2.1
LED_BUS4
  Bottom 0.254: PORT4.3 64.2,8.06 68.96,8.06 71.82,10.91 71.82,15.9 66.23,21.23 66.23,37.22 70.41,41.4 72.58,41.4 73.62,42.44 73.62,53.05 72.78,53.89 70.48,53.89 69.85,54.27 68.45,55.37 65.15,58.67 63.25,58.67 61.16,60.76 61.16,61.17 61.16,66.26 60.3,67.12 45.79,67.12 DUE_DIGITAL2.2
LED_BUS5  (via drill 0.3 pad 0.61)
  Top 0.254: v75.22,48.08 74.28,49.02 68.58,49.02 61.41,55.94 56.96,55.94 DUE_DIGITAL2.3
  Bottom 0.254: v75.22,48.08 75.22,44.55 78.37,41.4 80.17,41.4 80.95,40.63 80.95,28.67 75.51,23.22 75.51,8.24 75.67,8.08 78.05,8.08 PORT5.3
LED_BUS6  (via drill 0.3 pad 0.61)
  Top 0.254: v74.44,53.95 69.28,53.95 66.15,57.09 58.23,57.09 DUE_DIGITAL2.4
  Bottom 0.254: PORT6.3 94.56,8.08 91.35,8.08 84.81,17.67 84.93,45.23 80.89,49.02 78.36,49.02 74.79,52.59 74.79,53.6 v74.44,53.95
LED_BUS7  (via drill 0.3 pad 0.61)
  Top 0.254: v100.07,19.05 100.07,20.05 100.07,21.72 96.52,24.77 94.36,24.77 93.73,23.88 79.73,23.88 79.12,23.88 71.12,31.88 71.12,32.37 71.12,34.42 68.26,37.29 v59.95,37.29
  Bottom 0.254: v59.95,37.29 55.82,37.29 52.07,41.04 DUE_DIGITAL2.5 | PORT7.3 111.07,8.08 108.36,8.08 101.72,16.88 v100.07,19.05
LED_BUS8  (via drill 0.3 pad 0.61)
  Top 0.254: DUE_DIGITAL2.6 59.52,60.88 62.97,60.88 63.23,61.13 64.28,61.13 66.14,59.28 v80.19,59.28
  Bottom 0.254: PORT8.3 127.84,8.08 125.52,8.08 124.77,8.83 124.77,11.22 105.72,30.28 105.72,47.16 106.53,47.97 108.3,47.97 109.17,48.84 109.17,49.68 108.31,50.55 106.09,50.55 103.58,53.05 96.42,53.05 95.11,54.36 85.11,54.36 v80.19,59.28
N$1
  Bottom 0.254: U$4.S 14.22,47.75 R2.P$1
N$2
  Bottom 0.254: U$3.S 33.27,70.19 35.35,70.19 39.19,66.35 39.19,55.2 R3.P$1
N$3
  Top 0.254: OPTOCOUPLE.1 15.24,34.62 11.61,34.62 R2.P$2
N$4
  Top 0.254: OPTOCOUPLE.4 22.86,34.62 26.24,34.62 R3.P$2
N$5
  Top 0.254: OPTOCOUPLE.2 17.78,38.02 11.68,44.12 U$4.GND
N$6
  Top 0.254: OPTOCOUPLE.3 20.32,40.26 19.05,41.66 19.05,64.01 18.16,64.77 18.16,70.23 19.81,71.88 U$3.GND
N$7
  Top 0.254: U$1.S 52.58,70.19 62.4,70.19 R4.P$1
  Bottom 0.254: R4.P$1 Q3.D
N$8
  Top 0.254: U$2.S 72.14,70.19 82.46,70.19 R5.P$1
  Bottom 0.254: R5.P$1 86.11,66.55 Q4.D
N$9
  Bottom 0.254: VALVE_REGISTER.19 54.61,31.83 43.77,20.99 43.77,16.14 35.17,7.54 20.27,7.54 PORT1.7
N$10
  Bottom 0.254: PORT2.7 36.32,9.4 43.26,16.35 43.26,23.02 52.07,31.83 VALVE_REGISTER.20
N$11
  Bottom 0.254: VALVE_REGISTER.1 50.81,25.91 44.28,19.38 44.28,15.91 41.44,13.07 41.44,8.62 42.51,7.55 49.59,7.55 PORT3.7
N$12
  Bottom 0.254: PORT4.7 69.33,9.4 71.18,11.13 71.18,13.93 60.78,24.21 59.24,24.21 58.42,25.03 58.42,26.8 57.56,27.66 56.36,27.66 VALVE_REGISTER.2
N$13
  Bottom 0.254: PORT5.7 82.62,7.56 75.47,7.56 73.15,9.88 73.15,23.45 72.39,24.21 VALVE_REGISTER.9
N$14  (via drill 0.3 pad 0.61)
  Top 0.254: VALVE_REGISTER.10 74.93,24.21 76.06,24.21 v77.25,23.01
  Bottom 0.254: v77.25,23.01 77.25,22.34 78.88,22.34 84.33,16.89 90.64,7.55 99.12,7.55 PORT6.7
N$15  (via drill 0.3 pad 0.61)
  Top 0.254: VALVE_REGISTER.11 74.93,31.83 77.8,28.96 93.06,28.96 93.34,28.96 94.23,28.07 94.23,27.69 95.12,26.8 96.75,26.8 v97.67,25.88
  Bottom 0.254: PORT7.7 115.47,7.39 108.07,7.39 97.67,20.34 v97.67,25.88
N$16
  Top 0.254: PORT8.7 134.85,9.4 136.86,11.4 136.86,12.46 127.19,22.13 103.02,22.13 100.26,24.89 97.41,24.89 96.39,25.91 95,25.91 94.44,26.47 94.37,26.47 77.75,26.47 72.39,31.83 VALVE_REGISTER.12
N$17
  Bottom 0.254: SYNC_REGISTER.15 128.27,59.87 133.99,65.58 SYNC.2
N$18
  Top 0.254: SYNC_REGISTER.1 130.81,67.49 133.25,67.49 136.83,70.81 136.83,73.87 136.35,74.35 134.04,74.35 SYNC.3
N$19
  Bottom 0.254: SYNC_REGISTER.2 128.91,67.23 129.34,68 SYNC.4
N$20
  Bottom 0.254: VALVE_REGISTER.7 67.31,27.61 68.35,28.65 68.35,34.65 74.13,40.43 74.13,53.3 73.76,53.67 73.76,54.56 79.17,59.97 82.29,59.97 82.64,59.62 86.54,59.62 89.03,62.1 89.03,63.25 DUE_DIGITAL4.3
N$21
  Top 0.254: SYNC_REGISTER.3 123.83,63.63 120.27,63.63 119.38,64.64 119.38,67.44 126.36,74.42 128.65,74.42 SYNC.5
N$22
  Bottom 0.254: SYNC_REGISTER.4 125.31,67.91 126.58,68.29 SYNC.6
N$23
  Top 0.254: SYNC_REGISTER.5 120.65,67.49 125.81,72.64 SYNC.7
N$24
  Bottom 0.254: SYNC_REGISTER.6 118.11,67.49 122.73,69.14 SYNC.8
N$25
  Bottom 0.762: R1.P$2 55.88,47.75 59.94,51.82 63.01,51.82 U$8.P$2
N$26  (via drill 0.3 pad 0.61)
  Top 0.254: Q3.S 79.31,61.98 v82.16,59.13
  Bottom 0.254: DUE_DIGITAL4.5 89.03,60.71 87.43,59.11 82.18,59.11 v82.16,59.13
N$28
  Top 0.254: DUE_DIGITAL4.4 93.85,63.25 111.12,63.25 112.27,62.1 116.84,62.1 118.42,62.1 120.65,59.87 SYNC_REGISTER.12
N$29
  Top 0.254: DUE_DIGITAL4.6 91.57,60.71 91.57,60.47 90.61,59.52 85.8,59.52 84.61,60.71 Q4.S
N$30
  Bottom 0.254: 15.49,69.09 15.75,69.09
N$32
  Bottom 0.254: 5V_3V3_1.3 101.52,59.44 101.52,60.78 107.87,67.13 109.68,67.13 SERIAL1.4
N$33
  Top 0.254: DUE_DIGITAL3.3 78.79,64.47 81.39,64.47 84.35,61.51 85.21,61.51 85.67,61.98 5V_3V3_1.2
N$34  (via drill 0.3 pad 0.61)
  Top 0.254: SERIAL1.3 112.91,74.92 83.56,74.92 v80.16,71.02
  Bottom 0.254: v80.16,71.02 DUE_DIGITAL3.4
N$35
  Bottom 0.254: 5V_3V3_1.5 101.52,54.36 101.52,57.37 100.69,58.2 98.27,58.2 96.11,61.37 96.11,67.97 SERIAL2.4
N$36  (via drill 0.3 pad 0.61)
  Top 0.381: DUE_DIGITAL3.5 74.55,67.82 v92.58,67.82
  Bottom 0.381: v92.58,67.82 94.74,67.82 94.74,60.83 98.17,56.9 5V_3V3_1.4
N$37  (via drill 0.3 pad 0.61)
  Top 0.254: DUE_DIGITAL3.2 81.33,67.11 99.62,67.11 100.08,67.56 100.67,67.56 v100.85,67.61
  Bottom 0.254: v100.85,67.61 104.57,71.33 107.57,74.55 111,74.55 SERIAL1.5
N$39
  Bottom 0.254: DUE_DIGITAL4.21 90.17,41.53 90.41,41.53 91.57,42.69 91.57,45.94 92.24,46.61 93.02,46.61 98.12,51.71 98.12,51.82 5V_3V3_1.6
N$40
  Bottom 0.254: SERIAL2.3 90.59,76.29 84.76,76.29 84.15,79.05 82.1,79.43 80.03,78.89 80.03,75.97 DUE_DIGITAL3.6
N$41
  Bottom 0.254: 5V_3V3_1.10 105.74,49.28 104.63,50.38 98.75,50.38 94.1,45.74 94.1,42.64 93.12,41.66 92.36,41.66 91.31,40.61 91.31,39.85 90.46,38.99 90.17,38.99 DUE_DIGITAL4.23
N$42
  Top 0.254: SERIAL2.5 91.73,72.64
  Top 0.381: DUE_DIGITAL3.7 69.6,68.58 85.09,68.58 88.77,74.3 91.19,74.3 SERIAL2.5
N$43
  Top 0.254: 5V_3V3_2.2 73.33,55.37 74.37,56.42 88.24,56.42 89.03,55.63 DUE_DIGITAL4.9
N$44
  Top 0.254: 5V_3V3_2.4 73.33,50.29 74.37,51.33 87.27,51.33 89.03,53.09 DUE_DIGITAL4.11
N$45
  Top 0.254: 5V_3V3_2.6 73.33,45.21 77.14,49.02 87.5,49.02 89.03,50.55 DUE_DIGITAL4.13
N$46
  Top 0.254: 5V_3V3_2.10 80.95,42.67 82.45,44.17 90.49,44.17 91.31,44.99 91.31,46.01 90.46,46.86 90.17,46.86 DUE_DIGITAL4.15
N$47
  Top 0.254: 5V_3V3_2.12 80.95,47.75 83.24,45.47 DUE_DIGITAL4.17
N$48
  Bottom 0.254: 5V_3V3_2.15 80.95,55.37 80.95,53 89.88,44.07 90.17,44.07 DUE_DIGITAL4.19
N$49
  Top 0.254: 5V_3V3_3.3 125.73,51.38 128.71,51.38 129.54,52.21 129.54,53.97 135.99,60.43 U$6.P$19
N$50
  Top 0.254: U$6.P$18 132.61,50.88 121.16,50.88 120.65,51.38 5V_3V3_3.5
N$51
  Top 0.254: U$6.P$17 137.09,50.35 116.6,50.35 115.57,51.38 5V_3V3_3.7
N$52
  Top 0.254: 5V_3V3_3.9 113.03,43.76 135.5,43.76 U$6.P$16
SPI_CLK  (via drill 0.3 pad 0.61)
  Top 0.254: ICSP.3 58.32,41.56 58.32,37.95 61,35.27 61,32.61 66,27.61 69.85,27.61 VALVE_REGISTER.8 | v72.93,51.42 73.46,51.42 76.27,54.23 90.39,54.23 91.57,55.41 91.57,56.1 92.36,56.9 93.07,56.9 96.67,60.49 117.48,60.49 118.11,59.87 SYNC_REGISTER.11
  Bottom 0.254: ICSP.3 58.07,44.29 58.07,46.33 59.04,47.04 67.52,47.04 69.86,51.42 v72.93,51.42
SPI_DATA  (via drill 0.3 pad 0.61)
  Top 0.254: ICSP.4 63.55,42.93 64.88,41.59 90.45,41.59 91.57,42.71 91.57,43.4 92.26,44.1 94.31,44.1 99.42,39.23 v109.89,39.23
  Bottom 0.254: VALVE_REGISTER.18 57.15,35.23 58.19,36.27 60.01,36.27 63.63,39.9 63.63,41.53 ICSP.4 | v109.89,39.23 111.51,39.23 116.61,44.33 116.61,46.15 121.92,51.45 121.92,54 122.56,54.74 122.94,54.86 124.46,54.86 SYNC_REGISTER.14
UPPER_GND
  Top 0.254: OPTOCOUPLE.5 22.86,65.53 DUE_DIGITAL1.2 22.61,66.29 25.15,68.83 46.99,68.83 U$1.GND 50.04,72.14 52.32,74.42 54.48,74.42 56.39,72.52 68.96,72.52 U$2.GND
VCC
  Top 0.254: PORT1.2 12.66,11.94 14.03,10.57 15.1,10.57 15.3,10.77 16.37,10.77 16.57,10.57 17.64,10.57 17.84,10.77 18.91,10.77 19.07,10.62 22.47,10.62 23.79,11.94 PORT2.2 29.17,11.94 30.54,10.57 31.61,10.57 31.81,10.77 32.88,10.77 33.08,10.57 34.15,10.57 34.35,10.77 35.42,10.77 35.61,10.58 42.48,10.58 43.83,11.94 PORT3.2 45.68,11.94 47.05,10.57 48.12,10.57 48.32,10.77 49.39,10.77 49.59,10.57 50.66,10.57 50.86,10.77 51.93,10.77 52.09,10.61 53.91,10.61 55.24,11.94 PORT4.2 62.27,11.94 63.64,10.57 64.71,10.57 64.91,10.77 65.98,10.77 66.18,10.57 67.25,10.57 67.45,10.77 68.52,10.77 68.67,10.62 73.95,10.62 75.28,11.94 PORT5.2 78.7,11.94 80.07,10.57 81.14,10.57 81.34,10.77 82.41,10.77 82.61,10.57 83.68,10.57 83.88,10.77 84.95,10.77 85.11,10.62 88.51,10.62 89.83,11.94 PORT6.2 95.29,11.94 96.66,10.57 97.73,10.57 97.93,10.77 99,10.77 99.2,10.57 100.27,10.57 100.47,10.77 101.54,10.77 101.74,10.57 105.73,10.57 107.1,11.94 PORT7.2 111.8,11.94 113.17,10.57 114.24,10.57 114.44,10.77 115.51,10.77 115.71,10.57 116.78,10.57 116.98,10.77 118.05,10.77 118.25,10.57 124.48,10.57 125.85,11.94 PORT8.2 | Q4.G 85.88,62.61 87.78,64.52 5V_3V3_1.1
  Bottom 0.254: OPTOCOUPLE.8 15.24,42.24 12.06,39.06 PORT1.2
  Bottom 0.381: Q3.G 5V_3V3_2.1 76.96,61.59 81.53,61.59 Q4.G | 5V_3V3_1.1 99.69,66.55 99.57,68.07 106.68,75.44 118.75,75.44 118.75,71.88 116.84,68.96 116.84,68.58 116.84,64.01 120.02,61.47 127,61.47 127,56.52 130.81,54.74 5V_3V3_3.1 132.08,51.94 132.08,43.18 130.94,42.16 128.27,40.01 128.27,34.54 128.27,15.49 PORT8.2 | DUE_PWR.2 PORT2.2

### Text on the board
tPlace: Serial 2 | Input Ch1 | Input Ch2 | Output Ch1 | Output Ch2 | Serial 1 | State SYNC | Status / LED | Bpod r0.5 | Spring terminal | Open source animal behavior measurement & control | Port 1 | Port 8